# EAGLE schematic CY8CKIT-032_Schematic (EAGLE 7.5.0)

## Sheet 1 of 4: User Interface
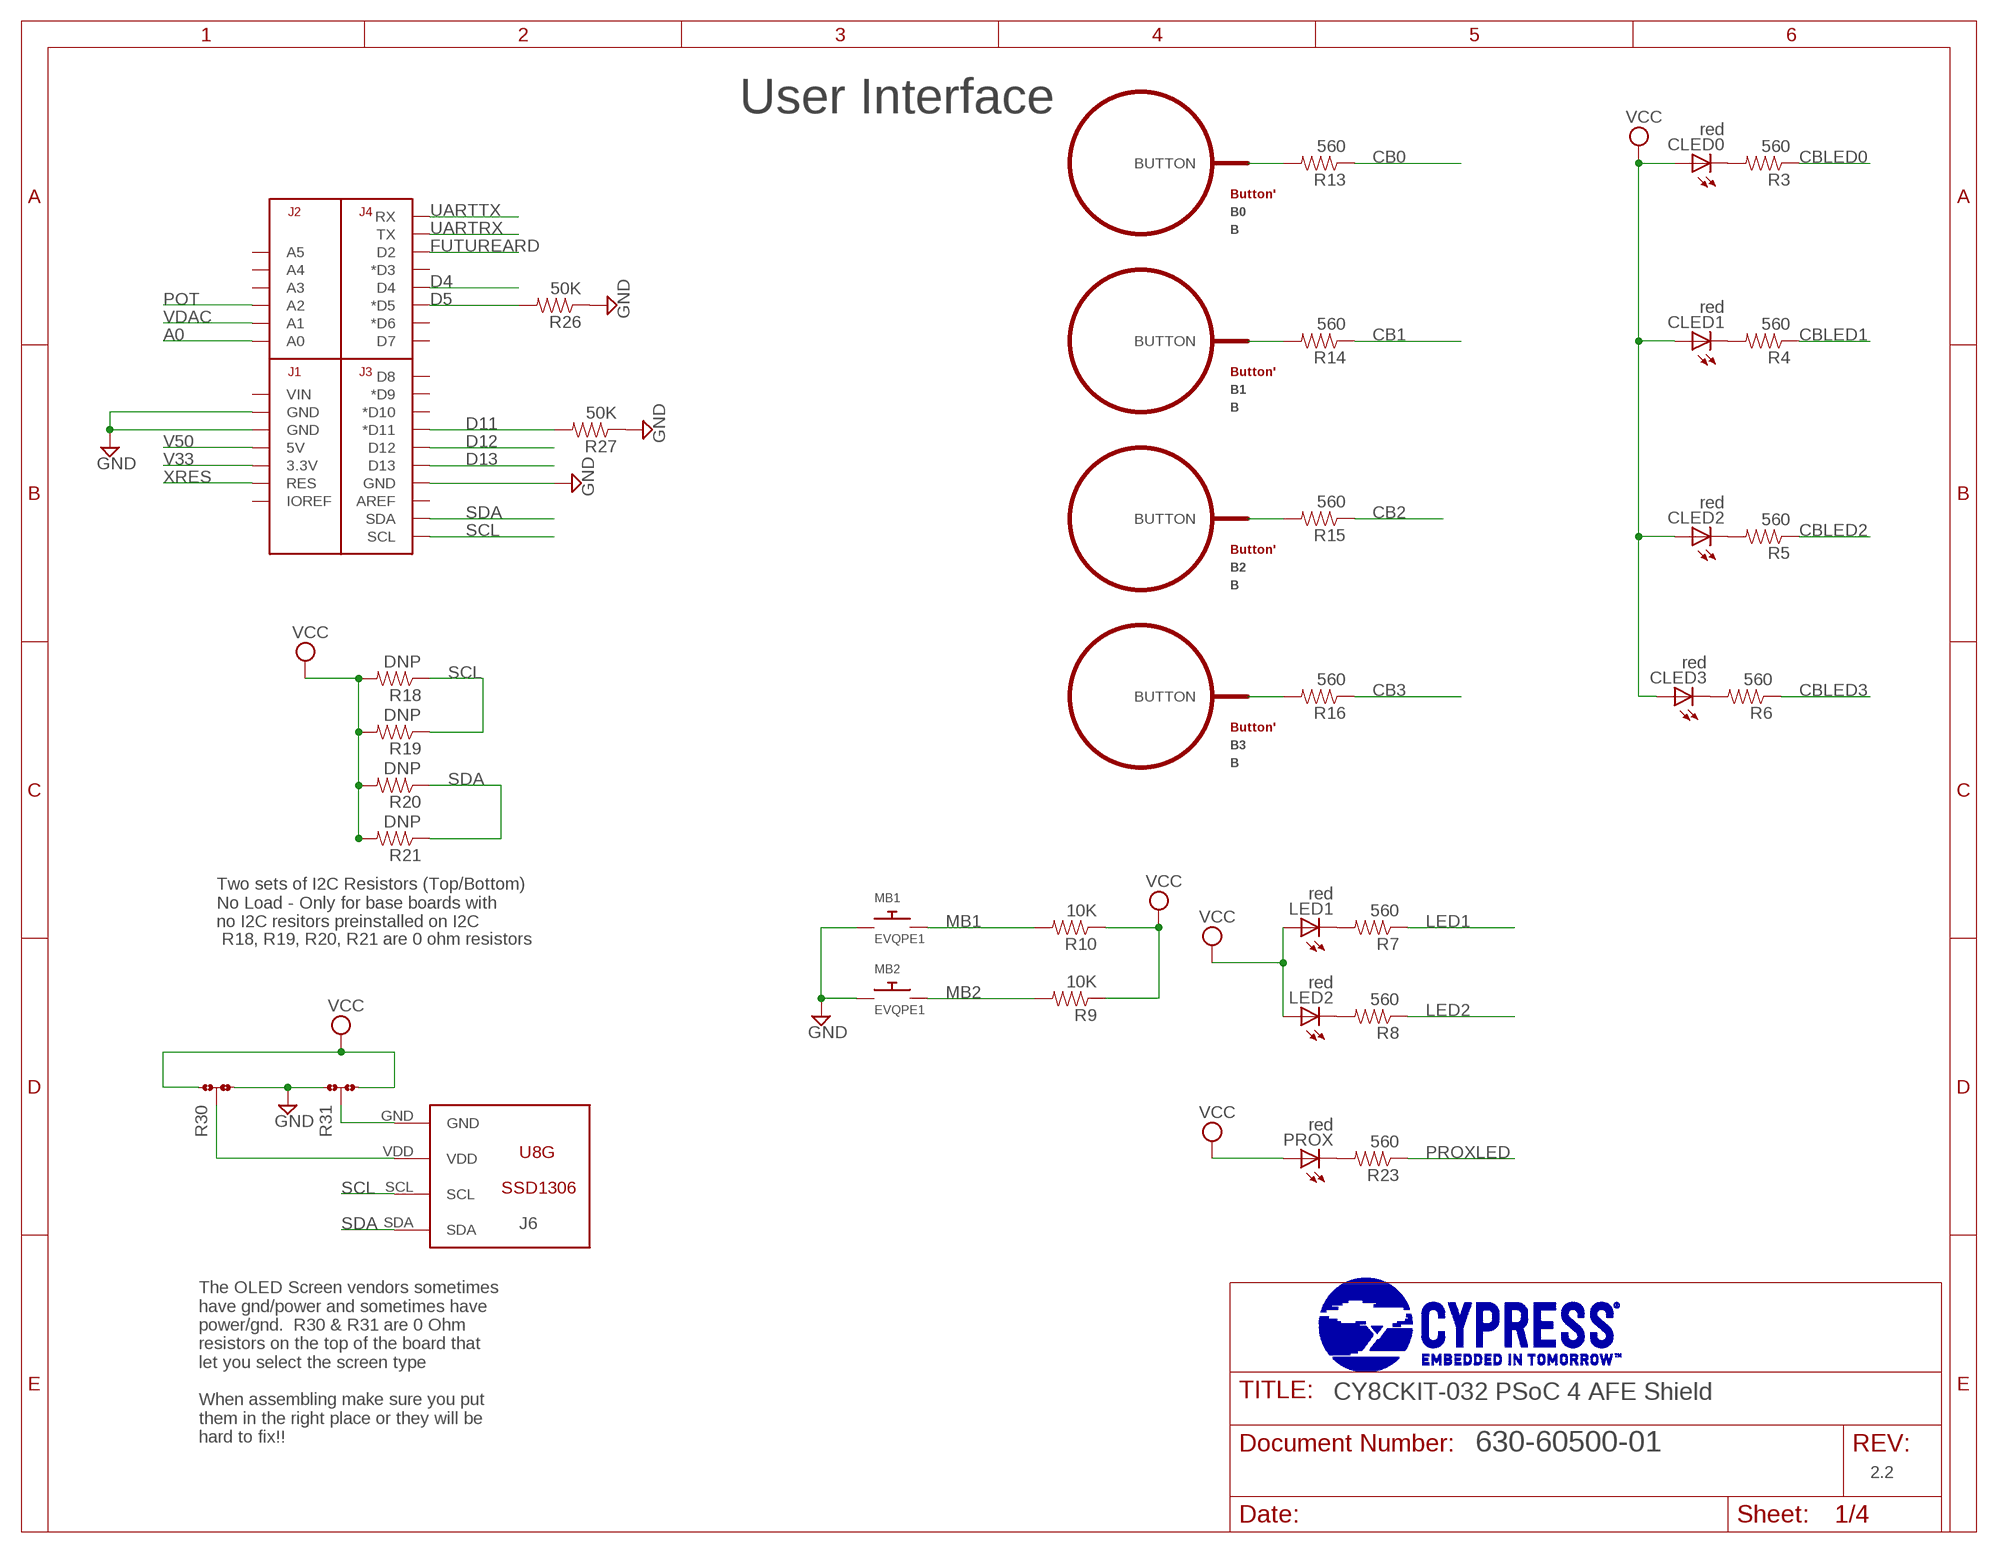
[diagram p0: schematic, sheet 1]

### Parts
B0  B  BUTTON_PASSIVE10MM  [BUTTON_PASSIVE_10MM]
B1  B  BUTTON_PASSIVE10MM  [BUTTON_PASSIVE_10MM]
B2  B  BUTTON_PASSIVE10MM  [BUTTON_PASSIVE_10MM]
B3  B  BUTTON_PASSIVE10MM  [BUTTON_PASSIVE_10MM]
CLED0  red  LEDCHIP-LED0603  [CHIP-LED0603]
CLED1  red  LEDCHIP-LED0603  [CHIP-LED0603]
CLED2  red  LEDCHIP-LED0603  [CHIP-LED0603]
CLED3  red  LEDCHIP-LED0603  [CHIP-LED0603]
J6  U8G-096-OLED  [096-SSD1306]
LED1  red  LEDCHIP-LED0603  [CHIP-LED0603]
LED2  red  LEDCHIP-LED0603  [CHIP-LED0603]
MB1  EVQPE1  [SWITCH]
MB2  EVQPE1  [SWITCH]
PROX  red  LEDCHIP-LED0603  [CHIP-LED0603]
R3  560  RESISTOR0603  [0603-RES]
R4  560  RESISTOR0603  [0603-RES]
R5  560  RESISTOR0603  [0603-RES]
R6  560  RESISTOR0603  [0603-RES]
R7  560  RESISTOR0603  [0603-RES]
R8  560  RESISTOR0603  [0603-RES]
R9  10K  RESISTOR0603  [0603-RES]
R10  10K  RESISTOR0603  [0603-RES]
R13  560  RESISTOR0603  [0603-RES]
R14  560  RESISTOR0603  [0603-RES]
R15  560  RESISTOR0603  [0603-RES]
R16  560  RESISTOR0603  [0603-RES]
R18  DNP  RESISTOR0603  [0603-RES]
R19  DNP  RESISTOR0603  [0603-RES]
R20  DNP  RESISTOR0603  [0603-RES]
R21  DNP  RESISTOR0603  [0603-RES]
R23  560  RESISTOR0603  [0603-RES]
R26  50K  RESISTOR0603  [0603-RES]
R27  50K  RESISTOR0603  [0603-RES]
R30  JMP-3-1_2  [JMP-3-1_2]
R31  JMP-3-2_3  [JMP-3-2_3]
U$1  ARDUINO_R3_SHIELDNOLABELS  [UNO_R3_SHIELD_NOLABELS]

### Nets
A0: U$1.A0 ; also sheet 4
CB0: R13.1 ; also sheet 2
CB1: R14.1 ; also sheet 2
CB2: R15.1 ; also sheet 2
CB3: R16.1 ; also sheet 2
CBLED0: R3.1 ; also sheet 2
CBLED1: R4.1 ; also sheet 2
CBLED2: R5.1 ; also sheet 2
CBLED3: R6.1 ; also sheet 2
D4: U$1.D4 ; also sheet 2
D5: R26.2 U$1.D5(*D5) ; also sheet 2
D11: R27.2 U$1.D11(*D11) ; also sheet 2
D12: U$1.D12 ; also sheet 2
D13: U$1.D13 ; also sheet 2
FUTUREARD: U$1.D2 ; also sheet 2
GND: MB1.P$1 MB2.P$1 R26.1 R27.1 R30.3 R31.1 U$1.GND@0(GND) U$1.GND@1(GND) U$1.GND@2(GND) ; also sheet 2,3,4
LED1: R7.1 ; also sheet 2
LED2: R8.1 ; also sheet 2
MB1: MB1.P$2 R10.2 ; also sheet 2
MB2: MB2.P$2 R9.2 ; also sheet 2
N$2: B0.BUTTON R13.2
N$3: PROX.C R23.2
N$5: B1.BUTTON R14.2
N$7: B2.BUTTON R15.2
N$8: CLED0.C R3.2
N$9: CLED1.C R4.2
N$10: CLED2.C R5.2
N$11: CLED3.C R6.2
N$12: LED1.C R7.2
N$13: LED2.C R8.2
N$14: J6.VDD R30.2
N$15: B3.BUTTON R16.2
N$17: J6.GND R31.2
POT: U$1.A2 ; also sheet 2,4
PROXLED: R23.1 ; also sheet 2
SCL: J6.SCL R18.1 R19.1 U$1.SCL ; also sheet 2
SDA: J6.SDA R20.1 R21.1 U$1.SDA ; also sheet 2
UARTRX: U$1.TX ; also sheet 2
UARTTX: U$1.RX ; also sheet 2
V33: U$1.3.3V ; also sheet 3
V50: U$1.5V ; also sheet 3
VCC: CLED0.A CLED1.A CLED2.A CLED3.A LED1.A LED2.A PROX.A R9.1 R10.1 R18.2 R19.2 R20.2 R21.2 R30.1 R31.3 ; also sheet 2,3,4
VDAC: U$1.A1 ; also sheet 2
XRES: U$1.RES ; also sheet 2
Unconnected: U$1.A3 U$1.A4 U$1.A5 U$1.AREF U$1.D3(*D3) U$1.D6(*D6) U$1.D7 U$1.D8 U$1.D9(*D9) U$1.D10(*D10) U$1.IOREF U$1.VIN

### Notes on the sheet
- User Interface
- Two sets of I2C Resistors (Top/Bottom)
  No Load - Only for base boards with
  no I2C resitors preinstalled on I2C
- R18, R19, R20, R21 are 0 ohm resistors
- J6
- CY8CKIT-032 PSoC 4 AFE Shield
- The OLED Screen vendors sometimes
  have gnd/power and sometimes have
  power/gnd.  R30 & R31 are 0 Ohm
  resistors on the top of the board that 
  let you select the screen type
  
  When assembling make sure you put
  them in the right place or they will be
  hard to fix!!
- 630-60500-01
- 2.2

## Sheet 2 of 4: PSoC
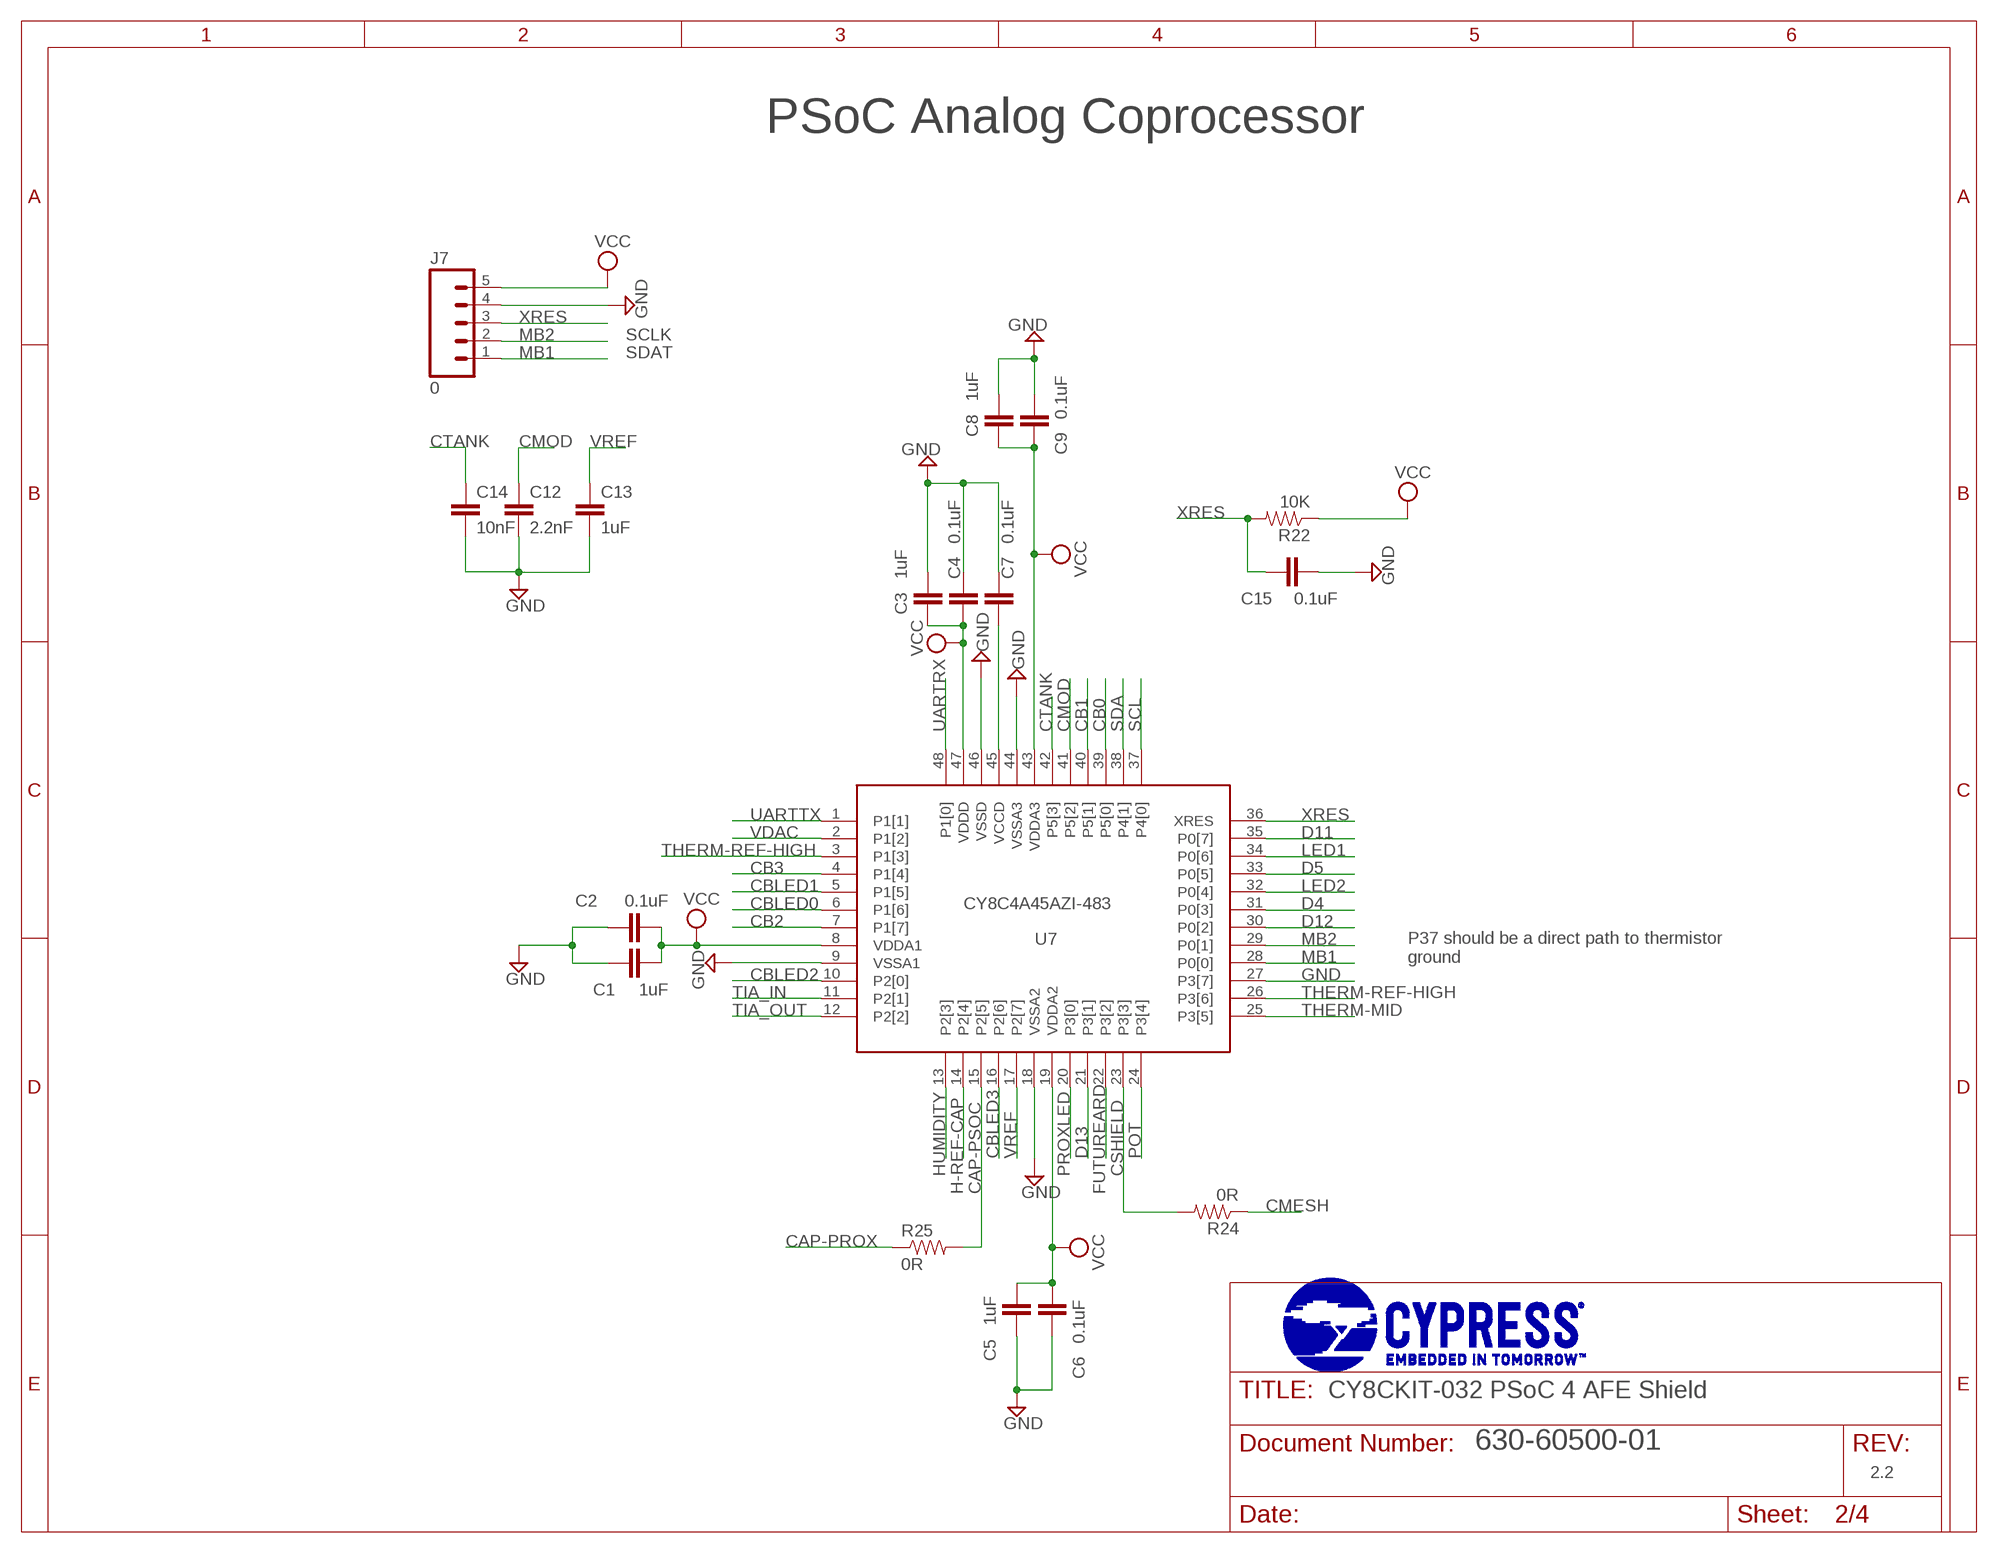
[diagram p1: schematic, sheet 2]

### Parts
C1  1uF  CAP0603-CAP  [0603-CAP]
C2  0.1uF  CAP0603-CAP  [0603-CAP]
C3  1uF  CAP0603-CAP  [0603-CAP]
C4  0.1uF  CAP0603-CAP  [0603-CAP]
C5  1uF  CAP0603-CAP  [0603-CAP]
C6  0.1uF  CAP0603-CAP  [0603-CAP]
C7  0.1uF  CAP0603-CAP  [0603-CAP]
C8  1uF  CAP0603-CAP  [0603-CAP]
C9  0.1uF  CAP0603-CAP  [0603-CAP]
C12  2.2nF  CAP0603-CAP  [0603-CAP]
C13  1uF  CAP0603-CAP  [0603-CAP]
C14  10nF  CAP0603-CAP  [0603-CAP]
C15  0.1uF  CAP0603-CAP  [0603-CAP]
J7  0  M05LOCK  [1X05_LOCK]
R22  10K  RESISTOR0603  [0603-RES]
R24  0R  RESISTOR0603  [0603-RES]
R25  0R  RESISTOR0603  [0603-RES]
U7  CY8C4A45-48  [TQFP-7X7-48]

### Nets
CAP-PROX: R25.1
CAP-PSOC: R25.2 U7.15(P2[5])
CB0: U7.39(P5[0]) ; also sheet 1
CB1: U7.40(P5[1]) ; also sheet 1
CB2: U7.7(P1[7]) ; also sheet 1
CB3: U7.4(P1[4]) ; also sheet 1
CBLED0: U7.6(P1[6]) ; also sheet 1
CBLED1: U7.5(P1[5]) ; also sheet 1
CBLED2: U7.10(P2[0]) ; also sheet 1
CBLED3: U7.16(P2[6]) ; also sheet 1
CMESH: R24.1
CMOD: C12.1 U7.41(P5[2])
CSHIELD: R24.2 U7.23(P3[3])
CTANK: C14.1 U7.42(P5[3])
D4: U7.31(P0[3]) ; also sheet 1
D5: U7.33(P0[5]) ; also sheet 1
D11: U7.35(P0[7]) ; also sheet 1
D12: U7.30(P0[2]) ; also sheet 1
D13: U7.21(P3[1]) ; also sheet 1
FUTUREARD: U7.22(P3[2]) ; also sheet 1
GND: C1.1 C2.1 C3.1 C4.1 C5.2 C6.2 C7.1 C8.1 C9.1 C12.2 C13.2 C14.2 C15.1 J7.4 U7.9(VSSA1) U7.18(VSSA2) U7.27(P3[7]) U7.44(VSSA3) U7.46(VSSD) ; also sheet 1,3,4
H-REF-CAP: U7.14(P2[4]) ; also sheet 4
HUMIDITY: U7.13(P2[3]) ; also sheet 4
LED1: U7.34(P0[6]) ; also sheet 1
LED2: U7.32(P0[4]) ; also sheet 1
MB1: J7.1 U7.28(P0[0]) ; also sheet 1
MB2: J7.2 U7.29(P0[1]) ; also sheet 1
N$20: C7.2 U7.45(VCCD)
POT: U7.24(P3[4]) ; also sheet 1,4
PROXLED: U7.20(P3[0]) ; also sheet 1
SCL: U7.37(P4[0]) ; also sheet 1
SDA: U7.38(P4[1]) ; also sheet 1
THERM-MID: U7.25(P3[5]) ; also sheet 4
THERM-REF-HIGH: U7.3(P1[3]) U7.26(P3[6]) ; also sheet 4
TIA_IN: U7.11(P2[1]) ; also sheet 4
TIA_OUT: U7.12(P2[2]) ; also sheet 4
UARTRX: U7.48(P1[0]) ; also sheet 1
UARTTX: U7.1(P1[1]) ; also sheet 1
VCC: C1.2 C2.2 C3.2 C4.2 C5.1 C6.1 C8.2 C9.2 J7.5 R22.1 U7.8(VDDA1) U7.19(VDDA2) U7.43(VDDA3) U7.47(VDDD) ; also sheet 1,3,4
VDAC: U7.2(P1[2]) ; also sheet 1
VREF: C13.1 U7.17(P2[7])
XRES: C15.2 J7.3 R22.2 U7.36(XRES) ; also sheet 1

### Notes on the sheet
- PSoC Analog Coprocessor
- SCLK
- SDAT
- CY8C4A45AZI-483
- U7
- P37 should be a direct path to thermistor
  ground
- CY8CKIT-032 PSoC 4 AFE Shield
- 630-60500-01
- 2.2

## Sheet 3 of 4: Power
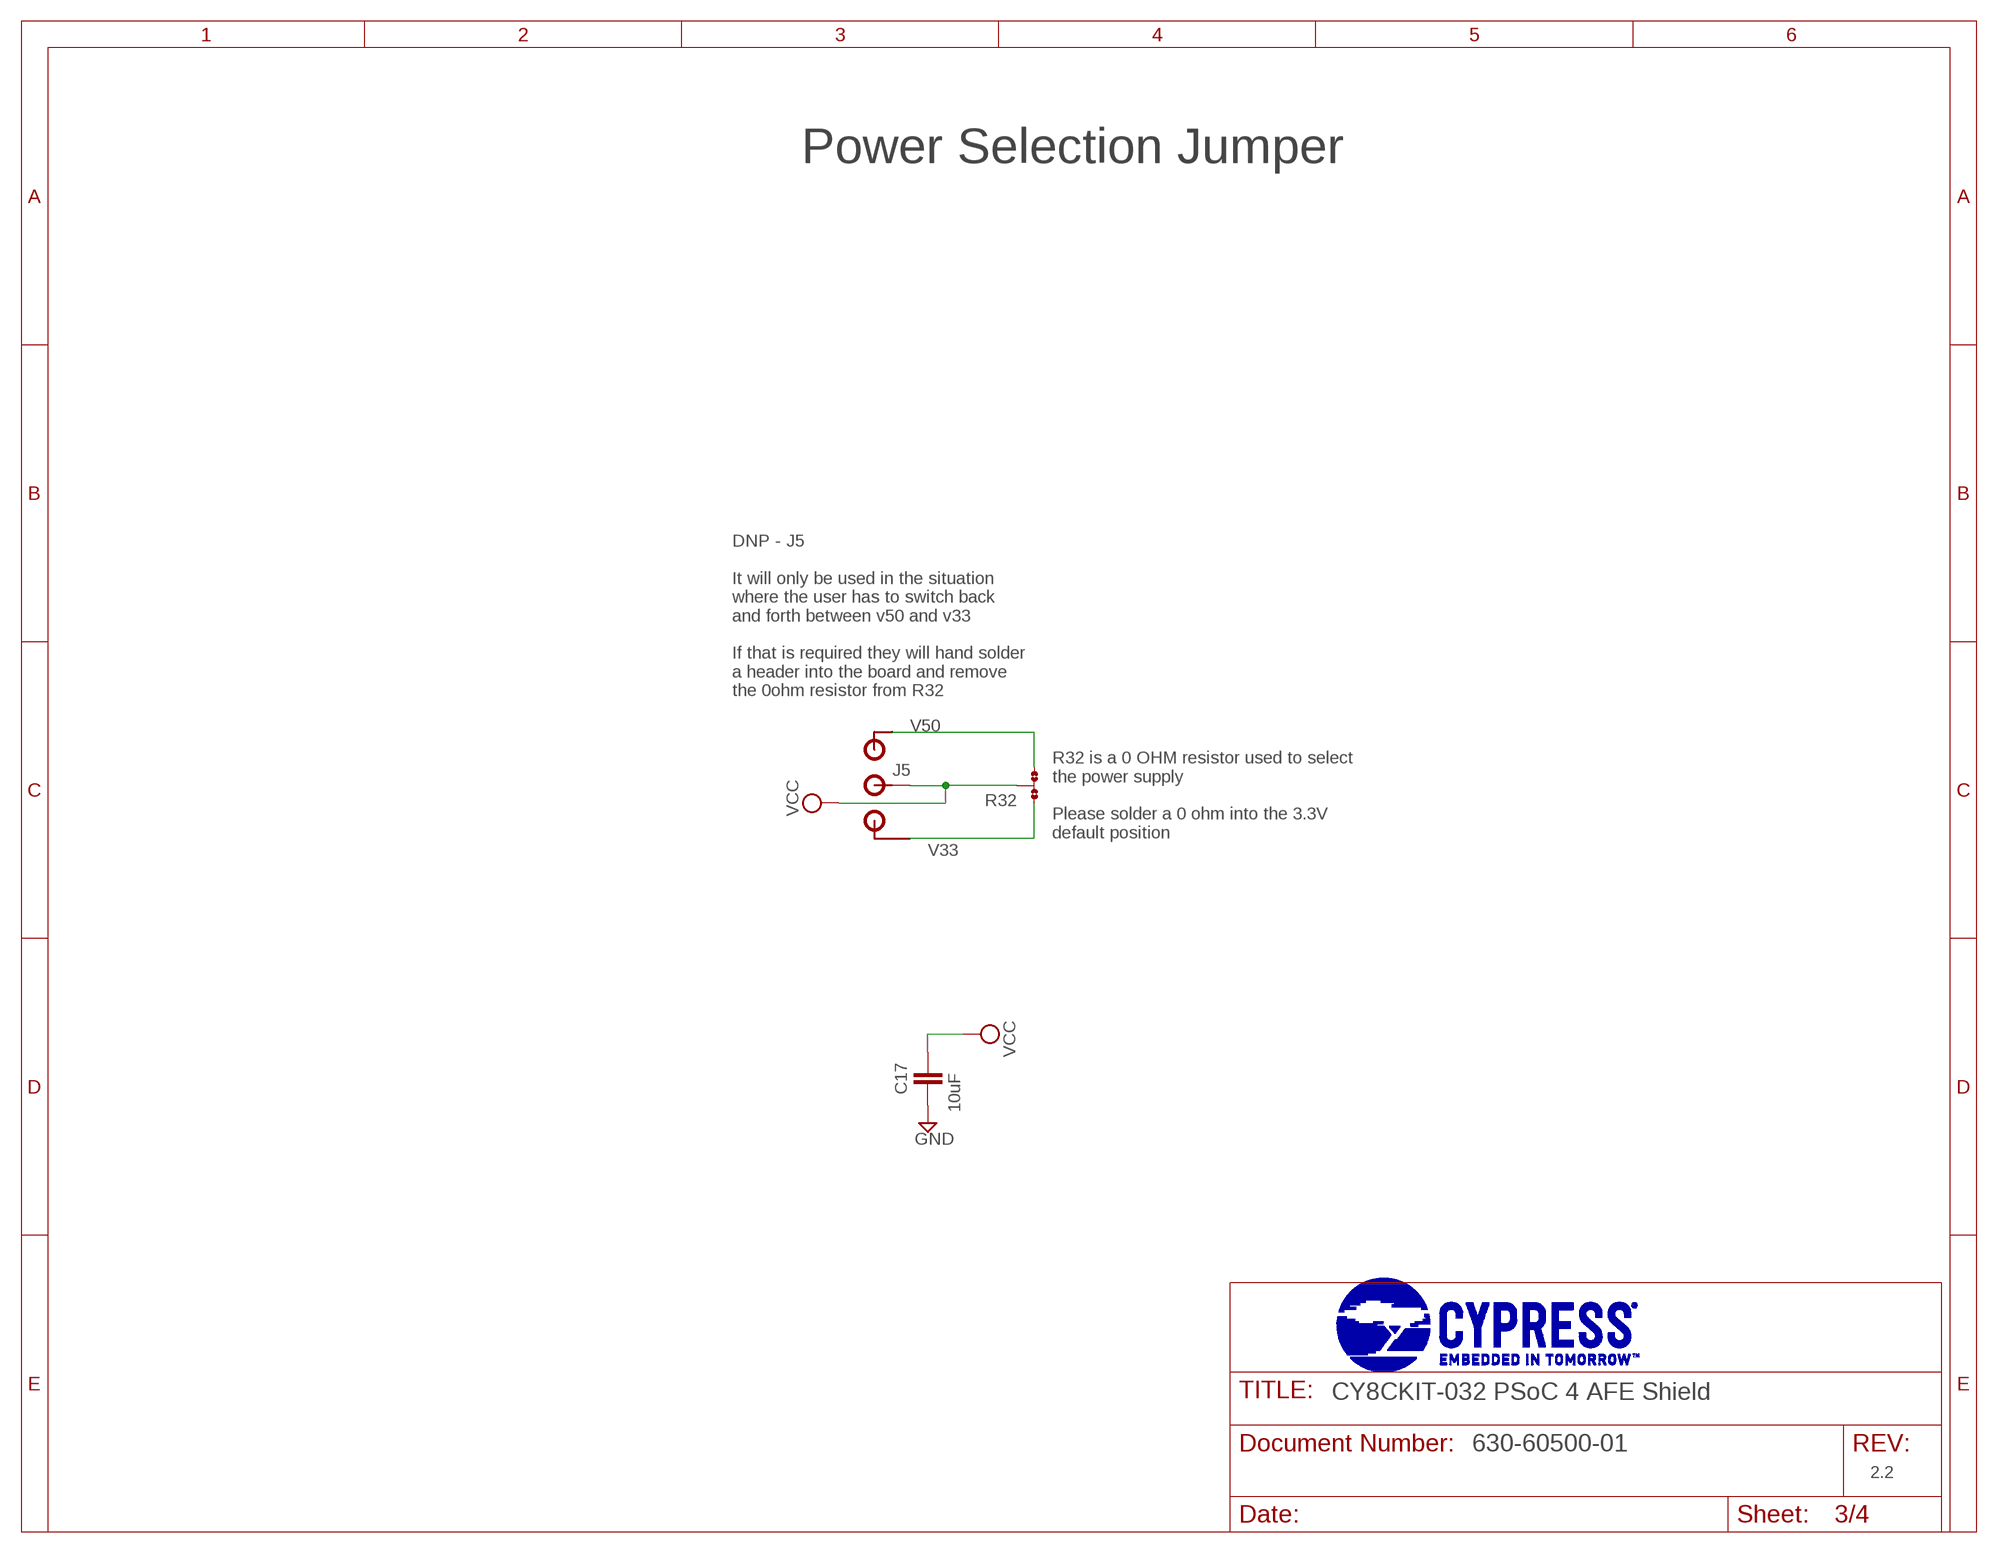
[diagram p2: schematic, sheet 3]

### Parts
C17  10uF  CAP0603-CAP  [0603-CAP]
J5  vcc  JMP-3-PTH-PTH  [JMP-3-NO-PTH-2.54]
R32  3.3v  JMP-3-NO  [JMP-3-NO]

### Nets
GND: C17.2 ; also sheet 1,2,4
V33: J5.3 R32.1 ; also sheet 1
V50: J5.1 R32.3 ; also sheet 1
VCC: C17.1 J5.2 R32.2 ; also sheet 1,2,4

### Notes on the sheet
- Power Selection Jumper
- DNP - J5
  
  It will only be used in the situation
  where the user has to switch back
  and forth between v50 and v33
  
  If that is required they will hand solder
  a header into the board and remove
  the 0ohm resistor from R32
- R32 is a 0 OHM resistor used to select
  the power supply
  
  Please solder a 0 ohm into the 3.3V
  default position
- CY8CKIT-032 PSoC 4 AFE Shield
- 630-60500-01
- 2.2

## Sheet 4 of 4: Sensor
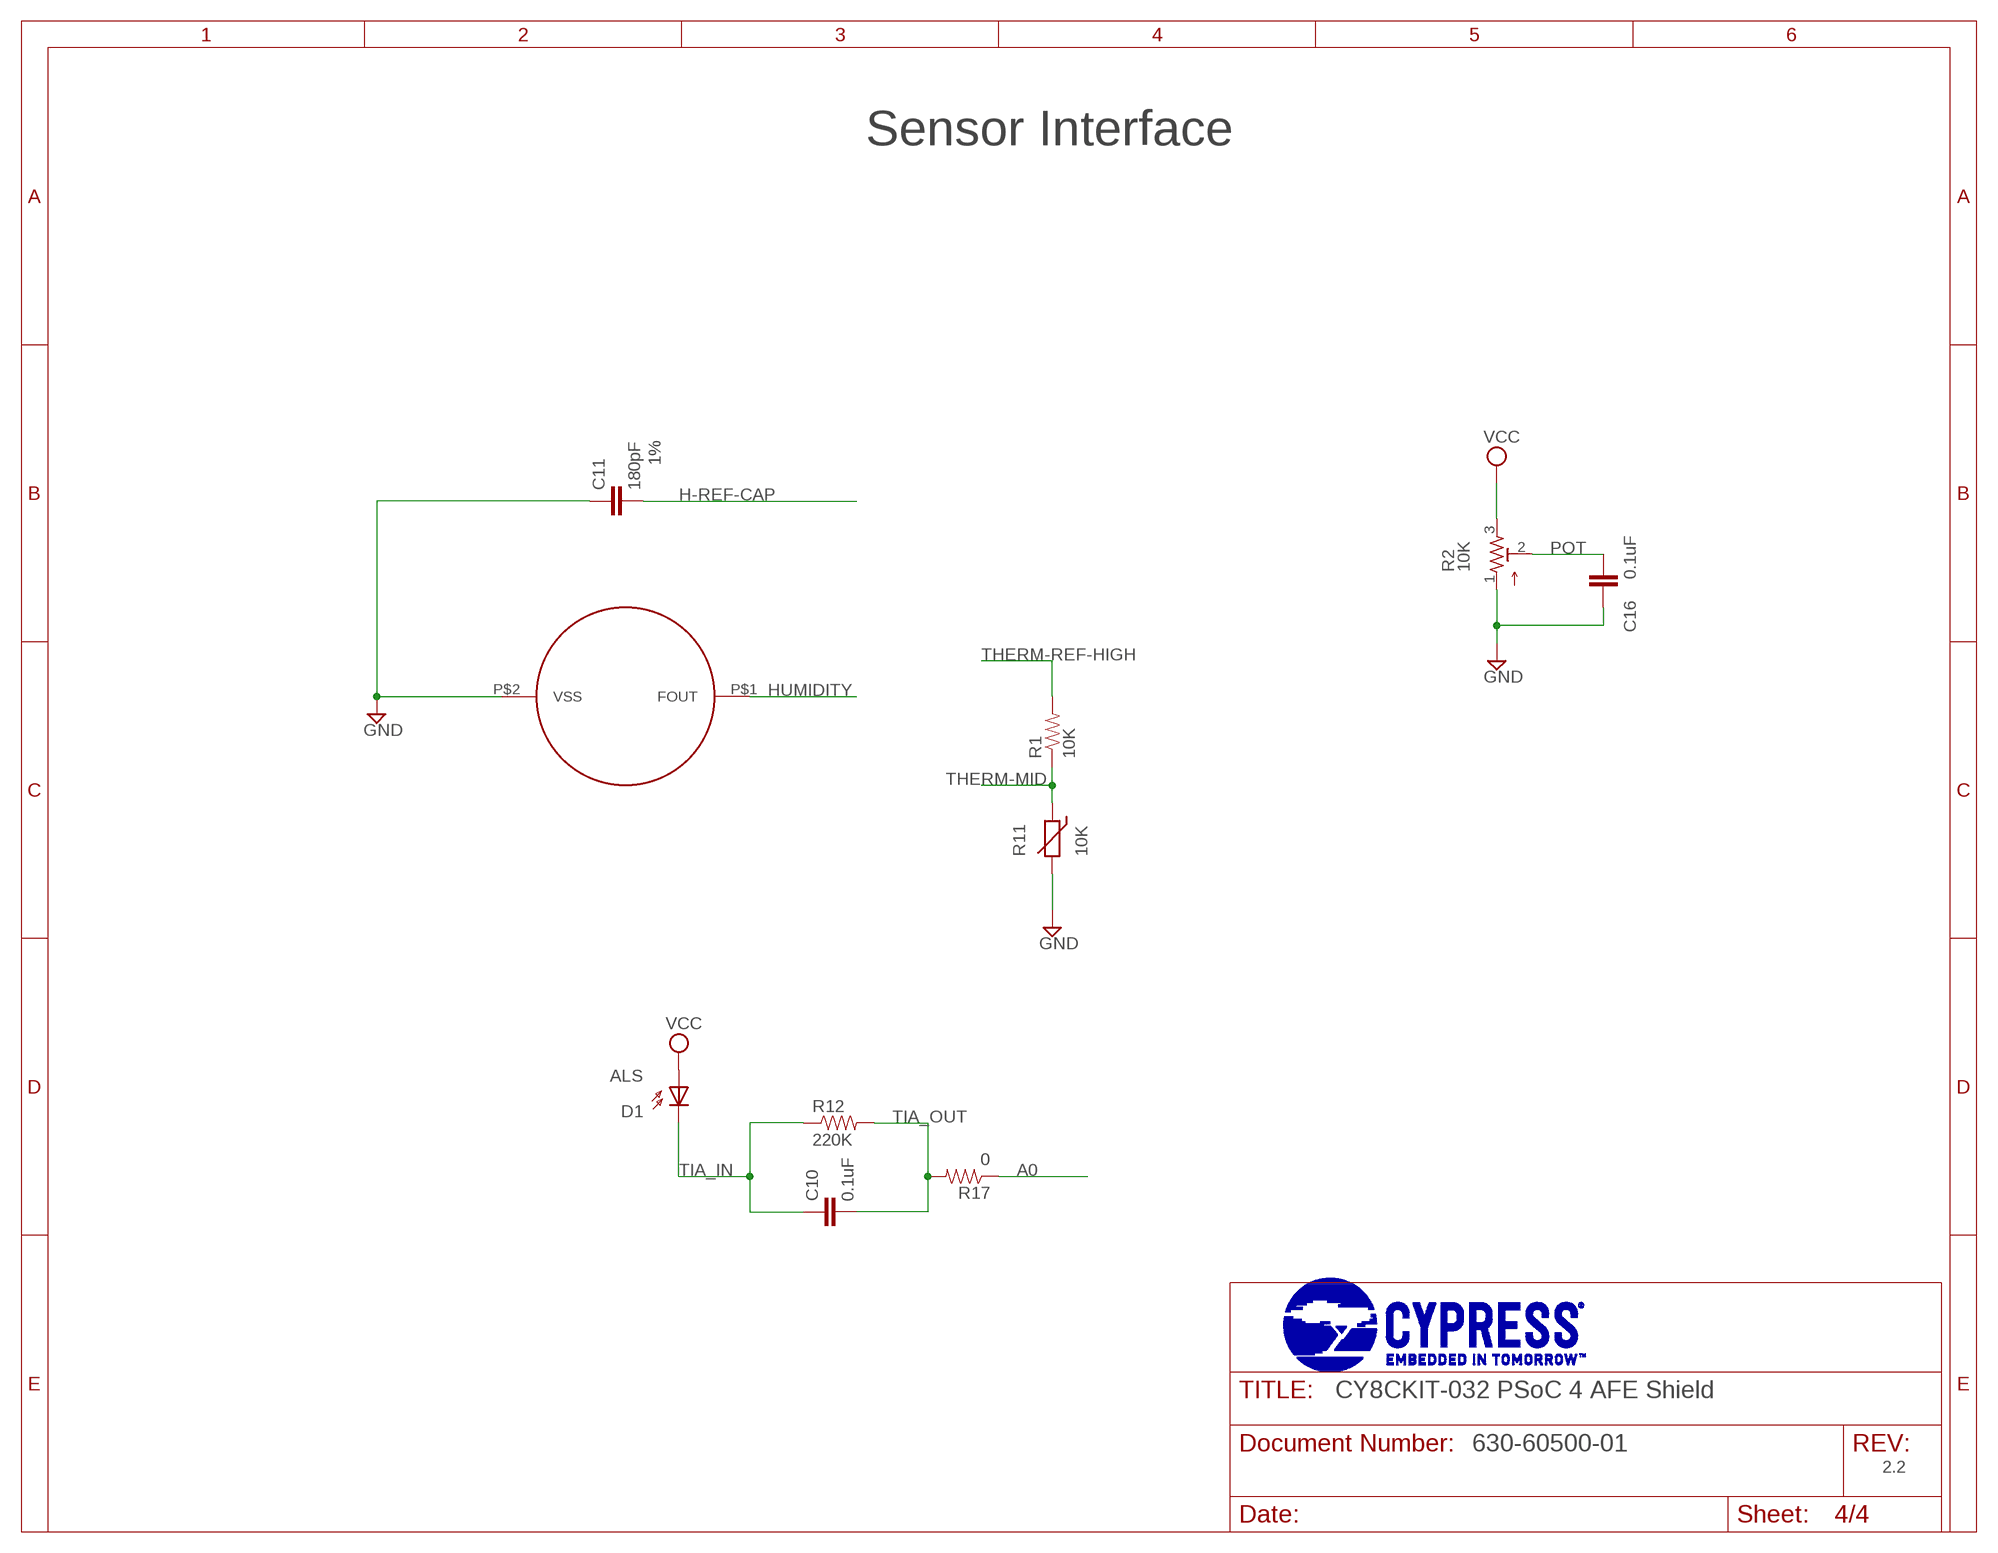
[diagram p3: schematic, sheet 4]

### Parts
C10  0.1uF  CAP0603-CAP  [0603-CAP]
C11  180pF  CAP0603-CAP  [0603-CAP]
C16  0.1uF  CAP0603-CAP  [0603-CAP]
D1  ALS  [ALS]
HUMIDITY  HPP801A031  [HUMIDITY]
R1  10K  RESISTOR0603  [0603-RES]
R2  10K  TRIM_US-3386P  [3386P]
R11  THERMISTOR-5  [R-5]
R12  220K  RESISTOR0603  [0603-RES]
R17  0  RESISTOR0603  [0603-RES]

### Nets
A0: R17.1 ; also sheet 1
GND: C11.1 C16.2 HUMIDITY.P$2(VSS) R2.1 R11.2 ; also sheet 1,2,3
H-REF-CAP: C11.2 ; also sheet 2
HUMIDITY: HUMIDITY.P$1(FOUT) ; also sheet 2
POT: C16.1 R2.2 ; also sheet 1,2
THERM-MID: R1.1 R11.1 ; also sheet 2
THERM-REF-HIGH: R1.2 ; also sheet 2
TIA_IN: C10.1 D1.CATHODE(C1) R12.1 ; also sheet 2
TIA_OUT: C10.2 R12.2 R17.2 ; also sheet 2
VCC: D1.ANNODE(E1) R2.3 ; also sheet 1,2,3

### Notes on the sheet
- Sensor Interface
- 1%
- 10K
- CY8CKIT-032 PSoC 4 AFE Shield
- 630-60500-01
- 2.2

## Library data of the parts
B0 B1-B3 = ww101board:BUTTON_PASSIVE: Button, Passive Capacitive/Touch Sensing Type Source : http://www.PatternAgents.com Github : https://github.com/PatternAgents License : http://creativecommons.org/licenses/by-sa/3.1/ (Creative Commons 3.1) THIS SOFTWARE IS PROVIDED BY THE CONTRIBUTORS "AS IS" AND WITHOUT ANY EXPRESS OR IMPLIED WARRANTIES, INCLUDING, BUT NOT LIMITED TO, THE IMPLIED WARRANTIES OF MERCHANTABILITY AND FITNESS FOR A PARTICULAR PURPOSE ARE DISCLAIMED. IN NO EVENT SHALL THE COPYRIGHT OWNER OR CONTRIBUTORS BE LIABLE FOR ANY DIRECT, INDIRECT, INCIDENTAL, SPECIAL, EXEMPLARY, OR CONSEQUENTIAL DAMAGES (INCLUDING, BUT NOT LIMITED TO, PROCUREMENT OF SUBSTITUTE GOODS OR SERVICES; LOSS OF USE, DATA, OR PROFITS; OR BUSINESS INTERRUPTION) HOWEVER CAUSED AND ON ANY THEORY OF LIABILITY, WHETHER IN CONTRACT, STRICT LIABILITY, OR TORT (INCLUDING NEGLIGENCE OR OTHERWISE) ARISING IN ANY WAY OUT OF THE USE OF THIS SOFTWARE, EVEN IF ADVISED OF THE POSSIBILITY OF SUCH DAMAGE.
C1-C17 = ww101board:CAP: Capacitor Standard 0603 ceramic capacitor, and 0.1" leaded capacitor.
CLED0 CLED1-CLED3 LED1 LED2 PROX = ww101board:LED: LED OSRAM: - CHIPLED LG R971, LG N971, LY N971, LG Q971, LY Q971, LO R971, LY R971 LH N974, LH R974 LS Q976, LO Q976, LY Q976 LO Q996 - Hyper CHIPLED LW Q18S LB Q993, LB Q99A, LB R99A - SideLED LS A670, LO A670, LY A670, LG A670, LP A670 LB A673, LV A673, LT A673, LW A673 LH A674 LY A675 LS A676, LA A676, LO A676, LY A676, LW A676 LS A679, LY A679, LG A679 - Hyper Micro SIDELED® LS Y876, LA Y876, LO Y876, LY Y876 LT Y87S - SmartLED LW L88C, LW L88S LB L89C, LB L89S, LG L890 LS L89K, LO L89K, LY L89K LS L896, LA L896, LO L896, LY L896 - TOPLED LS T670, LO T670, LY T670, LG T670, LP T670 LSG T670, LSP T670, LSY T670, LOP T670, LYG T670 LG T671, LOG T671, LSG T671 LB T673, LV T673, LT T673, LW T673 LH T674 LS T676, LA T676, LO T676, LY T676, LB T676, LH T676, LSB T676, LW T676 LB T67C, LV T67C, LT T67C, LS T67K, LO T67K, LY T67K, LW E67C LS E67B, LA E67B, LO E67B, LY E67B, LB E67C, LV E67C, LT E67C LW T67C LS T679, LY T679, LG T679 LS T770, LO T770, LY T770, LG T770, LP T770 LB T773, LV T773, LT T773, LW T773 LH T774 LS E675, LA E675, LY E675, LS T675 LS T776, LA T776, LO T776, LY T776, LB T776 LHGB T686 LT T68C, LB T68C - Hyper Mini TOPLED® LB M676 - Mini TOPLED Santana® LG M470 LS M47K, LO M47K, LY M47K Source: http://www.osram.convergy.de/
D1 = ww101board:ALS: Ambient Light Sensor Vishay TEMD6200FX01 http://www.vishay.com/docs/81812/temd6200.pdf
HUMIDITY = ww101board:HPP801A031
J5 = ww101board:JMP-3-PTH: Three Terminal Jumper - Normally Open All Pads Open (unconnected) PatternAgents ProtoPads Library Schematic and PCB layout libraries for design patterns by PatternAgents. For the CADSoft Eagle CAD program : http://www.cadsoftusa.com/download-eagle/ Source LBR : http://www.patternagents.com Github : https://github.com/PatternAgents License : http://creativecommons.org/licenses/by-sa/4.0/ (Creative Commons 4.0) THIS SOFTWARE IS PROVIDED BY THE CONTRIBUTORS "AS IS" AND WITHOUT ANY EXPRESS OR IMPLIED WARRANTIES, INCLUDING, BUT NOT LIMITED TO, THE IMPLIED WARRANTIES OF MERCHANTABILITY AND FITNESS FOR A PARTICULAR PURPOSE ARE DISCLAIMED. IN NO EVENT SHALL THE COPYRIGHT OWNER OR CONTRIBUTORS BE LIABLE FOR ANY DIRECT, INDIRECT, INCIDENTAL, SPECIAL, EXEMPLARY, OR CONSEQUENTIAL DAMAGES (INCLUDING, BUT NOT LIMITED TO, PROCUREMENT OF SUBSTITUTE GOODS OR SERVICES; LOSS OF USE, DATA, OR PROFITS; OR BUSINESS INTERRUPTION) HOWEVER CAUSED AND ON ANY THEORY OF LIABILITY, WHETHER IN CONTRACT, STRICT LIABILITY, OR TORT (INCLUDING NEGLIGENCE OR OTHERWISE) ARISING IN ANY WAY OUT OF THE USE OF THIS SOFTWARE, EVEN IF ADVISED OF THE POSSIBILITY OF SUCH DAMAGE.
J6 = ww101board:U8G-096-OLED
J7 = ww101board:M05: Header 5 Standard 5-pin 0.1" header. Use with straight break away headers (SKU : PRT-00116), right angle break away headers (PRT-00553), swiss pins (PRT-00743), machine pins (PRT-00117), and female headers (PRT-00115). Molex polarized connector foot print use with SKU : PRT-08230 with associated crimp pins and housings.
MB1 MB2 = ww101board:EVQPE1
R1 R3-R10 R12-R27 = ww101board:RESISTOR: Resistor Basic schematic elements and footprints for 0603, 1206, and PTH resistors.
R2 = ww101board:TRIM_US-: POTENTIOMETER
R11 = ww101board:THERMISTOR: THERMISTOR
R30 = ww101board:JMP-3-1_2: Three Terminal Jumper - 1 & 2 Connected Positions 1and 2 are normally connected. PatternAgents ProtoPads Library Schematic and PCB layout libraries for design patterns by PatternAgents. For the CADSoft Eagle CAD program : http://www.cadsoftusa.com/download-eagle/ Source LBR : http://www.patternagents.com Github : https://github.com/PatternAgents License : http://creativecommons.org/licenses/by-sa/4.0/ (Creative Commons 4.0) THIS SOFTWARE IS PROVIDED BY THE CONTRIBUTORS "AS IS" AND WITHOUT ANY EXPRESS OR IMPLIED WARRANTIES, INCLUDING, BUT NOT LIMITED TO, THE IMPLIED WARRANTIES OF MERCHANTABILITY AND FITNESS FOR A PARTICULAR PURPOSE ARE DISCLAIMED. IN NO EVENT SHALL THE COPYRIGHT OWNER OR CONTRIBUTORS BE LIABLE FOR ANY DIRECT, INDIRECT, INCIDENTAL, SPECIAL, EXEMPLARY, OR CONSEQUENTIAL DAMAGES (INCLUDING, BUT NOT LIMITED TO, PROCUREMENT OF SUBSTITUTE GOODS OR SERVICES; LOSS OF USE, DATA, OR PROFITS; OR BUSINESS INTERRUPTION) HOWEVER CAUSED AND ON ANY THEORY OF LIABILITY, WHETHER IN CONTRACT, STRICT LIABILITY, OR TORT (INCLUDING NEGLIGENCE OR OTHERWISE) ARISING IN ANY WAY OUT OF THE USE OF THIS SOFTWARE, EVEN IF ADVISED OF THE POSSIBILITY OF SUCH DAMAGE.; BOM: EXCLUDE
R31 = ww101board:JMP-3-2_3: Three Terminal Jumper - 2 & 3 Connected Positions 2 and 3 are normally connected. PatternAgents ProtoPads Library Schematic and PCB layout libraries for design patterns by PatternAgents. For the CADSoft Eagle CAD program : http://www.cadsoftusa.com/download-eagle/ Source LBR : http://www.patternagents.com Github : https://github.com/PatternAgents License : http://creativecommons.org/licenses/by-sa/4.0/ (Creative Commons 4.0) THIS SOFTWARE IS PROVIDED BY THE CONTRIBUTORS "AS IS" AND WITHOUT ANY EXPRESS OR IMPLIED WARRANTIES, INCLUDING, BUT NOT LIMITED TO, THE IMPLIED WARRANTIES OF MERCHANTABILITY AND FITNESS FOR A PARTICULAR PURPOSE ARE DISCLAIMED. IN NO EVENT SHALL THE COPYRIGHT OWNER OR CONTRIBUTORS BE LIABLE FOR ANY DIRECT, INDIRECT, INCIDENTAL, SPECIAL, EXEMPLARY, OR CONSEQUENTIAL DAMAGES (INCLUDING, BUT NOT LIMITED TO, PROCUREMENT OF SUBSTITUTE GOODS OR SERVICES; LOSS OF USE, DATA, OR PROFITS; OR BUSINESS INTERRUPTION) HOWEVER CAUSED AND ON ANY THEORY OF LIABILITY, WHETHER IN CONTRACT, STRICT LIABILITY, OR TORT (INCLUDING NEGLIGENCE OR OTHERWISE) ARISING IN ANY WAY OUT OF THE USE OF THIS SOFTWARE, EVEN IF ADVISED OF THE POSSIBILITY OF SUCH DAMAGE.; BOM: EXCLUDE
R32 = ww101board:JMP-3-NO: Three Terminal Jumper - Normally Open All Pads Open (unconnected) PatternAgents ProtoPads Library Schematic and PCB layout libraries for design patterns by PatternAgents. For the CADSoft Eagle CAD program : http://www.cadsoftusa.com/download-eagle/ Source LBR : http://www.patternagents.com Github : https://github.com/PatternAgents License : http://creativecommons.org/licenses/by-sa/4.0/ (Creative Commons 4.0) THIS SOFTWARE IS PROVIDED BY THE CONTRIBUTORS "AS IS" AND WITHOUT ANY EXPRESS OR IMPLIED WARRANTIES, INCLUDING, BUT NOT LIMITED TO, THE IMPLIED WARRANTIES OF MERCHANTABILITY AND FITNESS FOR A PARTICULAR PURPOSE ARE DISCLAIMED. IN NO EVENT SHALL THE COPYRIGHT OWNER OR CONTRIBUTORS BE LIABLE FOR ANY DIRECT, INDIRECT, INCIDENTAL, SPECIAL, EXEMPLARY, OR CONSEQUENTIAL DAMAGES (INCLUDING, BUT NOT LIMITED TO, PROCUREMENT OF SUBSTITUTE GOODS OR SERVICES; LOSS OF USE, DATA, OR PROFITS; OR BUSINESS INTERRUPTION) HOWEVER CAUSED AND ON ANY THEORY OF LIABILITY, WHETHER IN CONTRACT, STRICT LIABILITY, OR TORT (INCLUDING NEGLIGENCE OR OTHERWISE) ARISING IN ANY WAY OUT OF THE USE OF THIS SOFTWARE, EVEN IF ADVISED OF THE POSSIBILITY OF SUCH DAMAGE.
U7 = ww101board:CY8C4A45-48
U$1 = ww101board:ARDUINO_R3_SHIELD: Shield form compatible with the Arduino Uno R3.